# Altium schematic sheet SynchDemod.SchDoc
size Tabloid
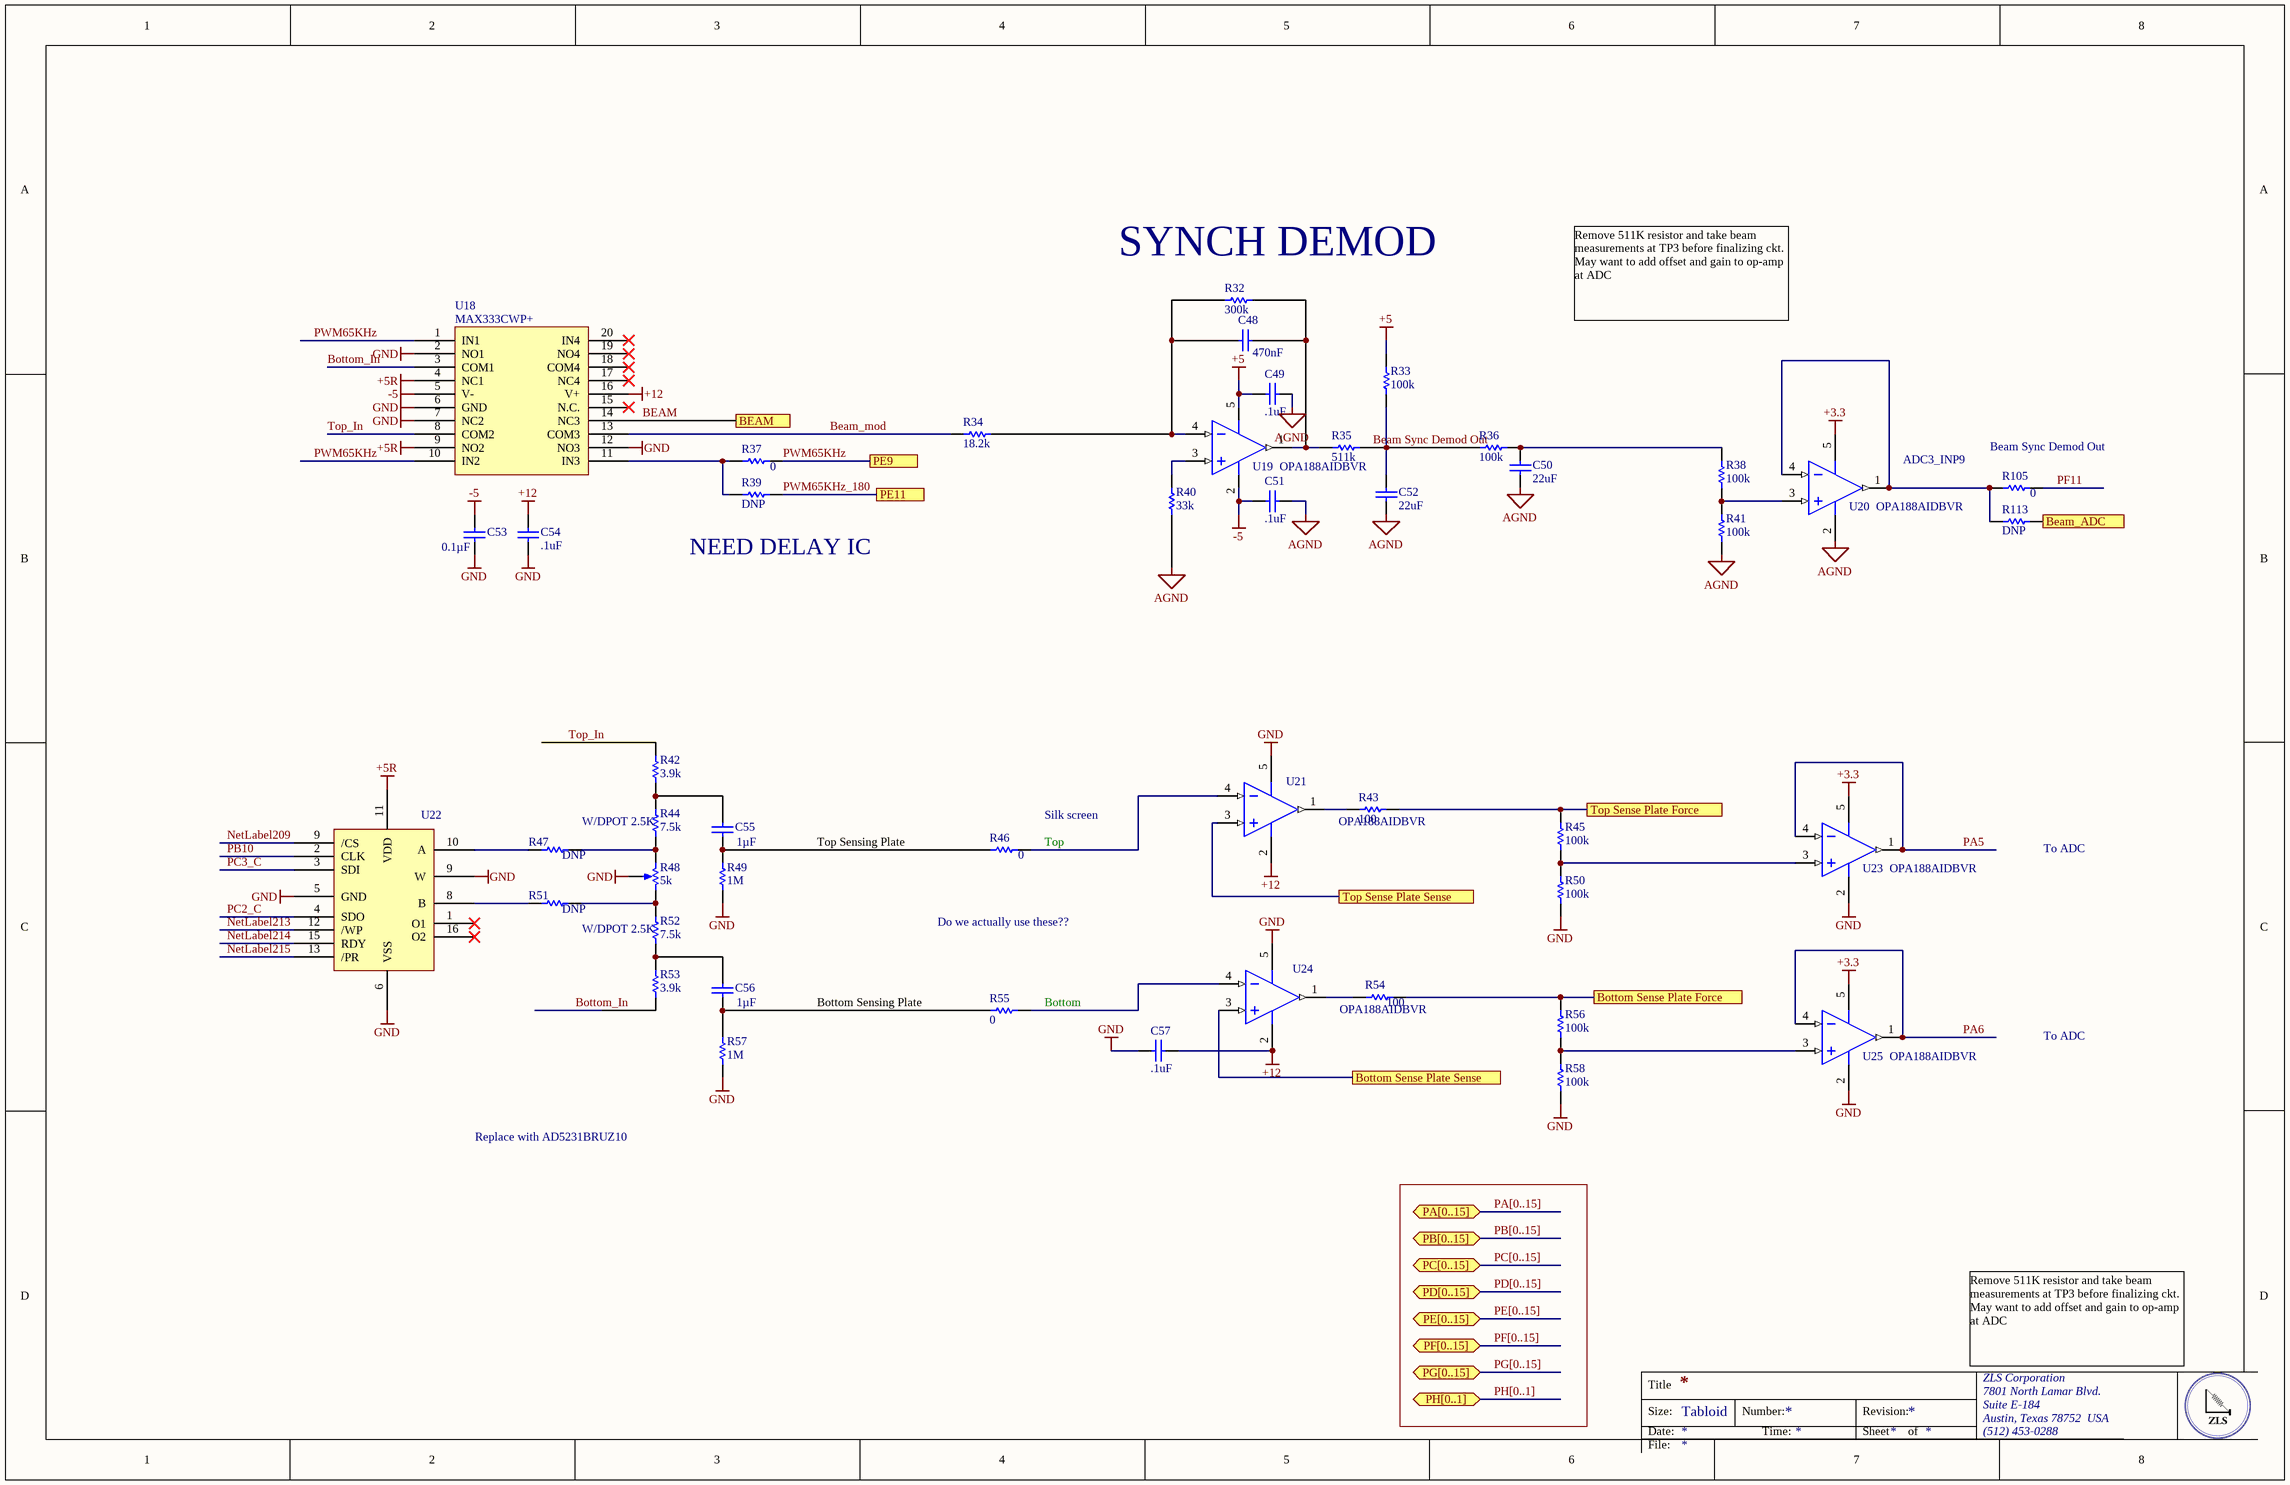
[diagram p0: SynchDemod.SchDoc]

## Parts
C48  470nF  [CAPC0805(2012)75_L]
C49  .1uF  [CAPC0805(2012)75_L]
C50  22uF  [CAPC0805(2012)75_L]
C51  .1uF  [CAPC0805(2012)75_L]
C52  22uF  [CAPC0805(2012)75_L]
C53  Capacitance: 0.1µF  [CAPC0805(2012)145_N]  (hidden comment: CAP CER 0.1UF 25V X7R 0805)
C54  .1uF  [CAPC0805(2012)75_L]
C55  Capacitance: 1µF  [CAPC0805(2012)155_L]  (hidden comment: CAP CER 1UF 25V X7R 0805)
C56  Capacitance: 1µF  [CAPC0805(2012)155_L]  (hidden comment: CAP CER 1UF 25V X7R 0805)
C57  .1uF  [CAPC0805(2012)75_M]
R32  300k  [RESC0805(2012)_L]
R33  100k  [RESC0805(2012)_L]
R34  18.2k  [RESC0805(2012)_L]
R35  511k  [RESC0805(2012)_L]
R36  100k  [RESC0805(2012)_L]
R37  0  [RESC0805(2012)_L]
R38  100k  [RESC0805(2012)_L]
R39  DNP  [RESC0805(2012)_L]
R40  33k  [RESC0805(2012)_L]
R41  100k  [RESC0805(2012)_L]
R42  3.9k  [RESC0805(2012)_L]
R43  100  [RESC0805(2012)_L]
R44  7.5k  [RESC0805(2012)_L]
R45  100k  [RESC0805(2012)_L]
R46  0  [RESC0805(2012)_L]
R47  DNP  [RESC0805(2012)_L]
R48  Resistance (Ohms): 5k  [Trimmer 2.54]  (hidden comment: TRIMMER 5K OHM 0.25W PC PIN)
R49  1M  [RESC0805(2012)_L]
R50  100k  [RESC0805(2012)_L]
R51  DNP  [RESC0805(2012)_L]
R52  7.5k  [RESC0805(2012)_L]
R53  3.9k  [RESC0805(2012)_L]
R54  100  [RESC0805(2012)_L]
R55  0  [RESC0805(2012)_L]
R56  100k  [RESC0805(2012)_L]
R57  1M  [RESC0805(2012)_L]
R58  100k  [RESC0805(2012)_L]
R105  0  [RESC0805(2012)_L]
R113  DNP  [RESC0805(2012)_L]
U18  MAX333CWP+  [TSOP65P640X90-20N]
U19  OPA188AIDBVR  [DBV0005A_M]
U20  OPA188AIDBVR  [DBV0005A_M]
U21  OPA188AIDBVR  [DBV0005A_M]
U22  AD5231BRUZ10  [AD5231BRUZ10]  (value not drawn)
U23  OPA188AIDBVR  [DBV0005A_M]
U24  OPA188AIDBVR  [DBV0005A_M]
U25  OPA188AIDBVR  [DBV0005A_M]

## Ports
BEAM, Beam_ADC, Bottom Sense Plate Force, Bottom Sense Plate Sense, PA[0..15] (bidir), PB[0..15] (bidir), PC[0..15] (bidir), PD[0..15] (bidir), PE9, PE11, PE[0..15] (bidir), PF[0..15] (bidir), PG[0..15] (bidir), PH[0..1] (bidir), Top Sense Plate Force, Top Sense Plate Sense

## Nets
+3.3: U20.5(V+) U23.5(V+) U25.5(V+)
+5: C49.1 R33.2 U19.5(V+)
+5R: U18.4(NC1) U18.9(NO2) U22.11(VDD)
+12: C54.2 C57.2 U18.16(V+) U21.2(V-) U24.2(V-)
-5: C51.1 C53.1 U18.5(V-) U19.2(V-)
AGND: C49.2 C50.1 C51.2 C52.1 R40.1 R41.1 U20.2(V-)
GND: C53.2 C54.1 C57.1 R48.2(b) R49.1 R50.1 R57.1 R58.1 U18.2(NO1) U18.6(GND) U18.7(NC2) U18.12(NO3) U21.5(V+) U22.5(GND) U22.6(VSS) U22.9(W) U23.2(V-) U24.5(V+) U25.2(V-)
BEAM: U18.14(NC3) ; port BEAM
Beam Sync Demod Out: C52.2 R33.1 R35.1 R36.2
Beam_ADC: R113.1 ; port Beam_ADC
Beam_mod: R34.2 U18.13(COM3)
Bottom Sense Plate Force: R54.1 R56.2 ; port Bottom Sense Plate Force
Bottom Sense Plate Sense: U24.3(IN+) ; port Bottom Sense Plate Sense
Bottom_In: R53.1 U18.3(COM1)
NetLabel209: U22.9(/CS)
NetLabel213: U22.12(/WP)
NetLabel214: U22.15(RDY)
NetLabel215: U22.13(/PR)
PA5: U23.1(OUT) U23.4(IN-)
PA6: U25.1(OUT) U25.4(IN-)
PB10: U22.2(CLK)
PC2_C: U22.4(SDO)
PC3_C: U22.3(SDI)
PF11: R105.1
PWM65KHz: R37.1 U18.1(IN1) U18.10(IN2) ; port PE9
PWM65KHz_180: R39.1 ; port PE11
Top Sense Plate Force: R43.1 R45.2 ; port Top Sense Plate Force
Top Sense Plate Sense: U21.3(IN+) ; port Top Sense Plate Sense
Top_In: R42.2 U18.8(COM2)
NetC48_1: C48.1 R32.2 R34.1 U19.4(IN-)
NetC48_2: C48.2 R32.1 R35.2 U19.1(OUT)
NetC50_2: C50.2 R36.1 R38.2
NetC55_1: C55.1 R46.2 R49.2
NetC55_2: C55.2 R42.1 R44.2
NetC56_1: C56.1 R55.2 R57.2
NetC56_2: C56.2 R52.1 R53.2
NetR37_2: R37.2 R39.2 U18.11(IN3)
NetR38_1: R38.1 R41.2 U20.3(IN+)
NetR40_2: R40.2 U19.3(IN+)
NetR43_2: R43.2 U21.1(OUT)
NetR44_1: R44.1 R47.1 R48.1(a)
NetR45_1: R45.1 R50.2 U23.3(IN+)
NetR46_1: R46.1 U21.4(IN-)
NetR47_2: R47.2 U22.10(A)
NetR48_3: R48.3(c) R51.1 R52.2
NetR51_2: R51.2 U22.8(B)
NetR54_2: R54.2 U24.1(OUT)
NetR55_1: R55.1 U24.4(IN-)
NetR56_1: R56.1 R58.2 U25.3(IN+)
NetR105_2: R105.2 R113.2 U20.1(OUT) U20.4(IN-)

Not connected (* = marked no-connect by the designer): U18 15(N.C.)* 17(NC4)* 18(COM4)* 19(NO4)* 20(IN4)*; U22 1(O1)* 16(O2)*

## Buses and harness runs
bus PA[0..15] = port PA[0..15]
bus PB[0..15] = port PB[0..15]
bus PC[0..15] = port PC[0..15]
bus PD[0..15] = port PD[0..15]
bus PE[0..15] = port PE[0..15]
bus PF[0..15] = port PF[0..15]
bus PG[0..15] = port PG[0..15]
bus PH[0..1] = port PH[0..1]

## Notes on the sheet
- (near R32) SYNCH DEMOD
- Remove 511K resistor and take beam measurements at TP3 before finalizing ckt.
  May want to add offset and gain to op-amp at ADC
- ADC3_INP9
- (near R105) Beam Sync Demod Out
- (near R39) NEED DELAY IC
- (near R44) W/DPOT 2.5K
- (near R46) Silk screen
- Top Sensing Plate
- (near R46) Top
- To ADC
- (near R52) W/DPOT 2.5K
- Do we actually use these??
- Bottom Sensing Plate
- (near R55) Bottom
- Replace with AD5231BRUZ10
- Title
- Size:
- Date:
- Tabloid
- Number:
- Time:
- Revision:
- Sheet
- of
- ZLS Corporation
- 7801 North Lamar Blvd.
- Suite E-184
- Austin, Texas 78752  USA
- (512) 453-0288
- File:

## Library data of the parts
C48 = CMP-1036-02117-1: CAP 150pF 16V ±10% 0805 (2012 Metric) Thickness 0.75mm SMD; Case-EIA: 0805; Tolerance: Â±10%; Value: .47uF; Case-Metric: 2012; Technology: SMT; Max Thickness: 0.75 mm; Rated Voltage: 16 V
C49-C52 C54 = CMP-1036-02117-1: CAP 150pF 16V ±10% 0805 (2012 Metric) Thickness 0.75mm SMD; Case-EIA: 0805; Tolerance: Â±10%; Case-Metric: 2012; Technology: SMT; Max Thickness: 0.75 mm; Rated Voltage: 16 V
  C49 C51 C54: Value: .1uF
  C50 C52: Value: 22uF
C53 = CMP-1036-04795-1: Manufacturer: Murata Electronics North America; Manufacturer Part Number: GRM21BR71E104KA01L; Tolerance: ±10%; Supplier 1: Digi-Key; Supplier Part Number 1: 490-1673-6-ND; RoHS: RoHS Compliant; Category: Capacitors; Stock 1: 891652; Pricing 1: 1=0.2, 10=0.145, 100=0.0683, 500=0.04788, 1000=0.03964 (USD); Packaging: Digi-Reel®; Part Status: Active; Voltage - Rated: 25V; Temperature Coefficient: X7R; Operating Temperature: -55°C ~ 125°C; Features: -; Ratings: -; Applications: General Purpose; Mounting Type: Surface Mount, MLCC; Package / Case: 0805 (2012 Metric); Size / Dimension: 0.079" L x 0.049" W (2.00mm x 1.25mm); Height - Seated (Max): -; Thickness (Max): 0.053" (1.35mm); Lead Spacing: -; Lead Style: -; ComponentLink1URL: http://www.murata.com/~/media/webrenewal/support/library/catalog/products/capacitor/mlcc/c02e.ashx; ComponentLink1Description: http://www.murata.com/~/media/webrenewal/support/library/catalog/products/capacitor/mlcc/c02e.ashx
C55 C56 = CMP-1036-04882-1: Manufacturer: Murata Electronics North America; Manufacturer Part Number: GRM21BR71E105KA99L; Tolerance: ±10%; Supplier 1: Digi-Key; Supplier Part Number 1: 490-6484-6-ND; RoHS: RoHS Compliant; Category: Capacitors; Stock 1: 295074; Pricing 1: 1=0.14, 10=0.099, 100=0.0468, 500=0.0328, 1000=0.02715 (USD); Packaging: Digi-Reel®; Part Status: Active; Voltage - Rated: 25V; Temperature Coefficient: X7R; Operating Temperature: -55°C ~ 125°C; Features: -; Ratings: -; Applications: General Purpose; Mounting Type: Surface Mount, MLCC; Package / Case: 0805 (2012 Metric); Size / Dimension: 0.079" L x 0.049" W (2.00mm x 1.25mm); Height - Seated (Max): -; Thickness (Max): 0.053" (1.35mm); Lead Spacing: -; Lead Style: -; ComponentLink1URL: http://www.murata.com/~/media/webrenewal/support/library/catalog/products/capacitor/mlcc/c02e.ashx; ComponentLink1Description: http://www.murata.com/~/media/webrenewal/support/library/catalog/products/capacitor/mlcc/c02e.ashx
C57 = CMP-1036-01414-1: CAP 33pF 25V ±2% 0805 (2012 Metric) Thickness 0.75mm SMD; Tolerance: Â±2%; Case-Metric: 2012; Case-EIA: 0805; Value: .1uF; Max Thickness: 0.75 mm; Rated Voltage: 25 V; Technology: SMT
R32-R38 R40-R42 R44-R46 R49 R50 R52 R53 R55-R58 R105 = CMP-1013-00215-1: 2R55 0.125W 1% 0805 (2012 Metric)  SMD; Case-Metric: 2012; Case-EIA: 0805; Tolerance: 1 %; Technology: SMT; Power: 0.125 W
  R32: Value: 300k
  R33 R36 R38 R41 R45 R50 R56 R58: Value: 100k
  R34: Value: 18.2k
  R35: Value: 511k
  R37 R46 R55 R105: Value: 0
  R40: Value: 33k
  R42 R53: Value: 3.9k
  R44 R52: Value: 7.5k
  R49 R57: Value: 1M
R39 R43 R47 R51 R54 R113 = CMP-1013-00215-1: 2R55 0.125W 1% 0805 (2012 Metric)  SMD; Case-Metric: 2012; Value: 0; Case-EIA: 0805; Tolerance: 1 %; Technology: SMT; Power: 0.125 W
R48 = Trimmer: Manufacturer: Vishay Foil Resistors (Division of Vishay Precision Group); Manufacturer Part Number: Y00535K00000J0L; Power (Watts): 0.25W, 1/4W; Tolerance: ±5%; Temperature Coefficient: ±10ppm/°C; Number of Turns: 21; Adjustment Type: Side Adjustment; Resistive Material: Metal Foil; Supplier 1: Digi-Key; Supplier Part Number 1: 804-1020-ND; RoHS: RoHS Compliant; Category: Potentiometers, Variable Resistors; Stock 1: 679; Pricing 1: 1=34.42, 10=32.265, 25=26.5292, 50=22.944, 100=22.227, 250=20.793, 500=19.2156 (USD); Packaging: Bulk; Part Status: Active; Mounting Type: Through Hole; Termination Style: PC Pins; Size / Dimension: Rectangular - 0.250" x 0.175" Face x 0.250" L (6.35mm x 4.45mm x 6.35mm); ComponentLink1URL: http://www.vishaypg.com/docs/63053/1240.pdf; ComponentLink1Description: http://www.vishaypg.com/docs/63053/1240.pdf
U18 = MAX333CWP+: IC SWITCH QUAD SPDT 20TSSOP; Manufacturer: Maxim; Manufacturer Part Number: MAX333AEUP+; Max Supply Voltage: 30V; Min Supply Voltage: 10V; Min Dual Supply Voltage: 4.5V; Max Dual Supply Voltage: 20V; On-State Resistance: 35R; Operating Supply Current: 1uA; Supply Type: Single,Dual; Max Power Dissipation: 559mW; Turn-On Delay Time: 175ns; Turn-Off Delay Time: 145ns; Max Supply Current: 250uA; Number of Bits: 4; Dual Supply Voltage: 15V; Supplier 1: Mouser; Supplier Part Number 1: 700-MAX333AEUP; Stock 1: 664; Pricing 1: 1=6.77, 10=6.43, 50=5.8, 100=5.8, 1000=5.62, 10000=5.62 (USD); Case/Package: TSSOP; Number of Pins: 20; Weight: 0.006737oz; Min Operating Temperature: -40°C; Max Operating Temperature: 85°C; Packaging: Rail/Tube; Package Quantity: 74; Throw Configuration: SPDT; Number of Channels: 4; Length: 6.6mm; Height: 0.95mm; Width: 4.5mm; Radiation Hardening: No; Lead Free: Lead Free; REACH SVHC: Unknown; ComponentLink1URL: https://datasheet.ciiva.com/2978/max333a-2978850.pdf; ComponentLink1Description: https://datasheet.ciiva.com/2978/max333a-2978850.pdf; ComponentLink2URL: https://datasheet.ciiva.com/30478/0900766b81253c85-30478260.pdf; ComponentLink2Description: https://datasheet.ciiva.com/30478/0900766b81253c85-30478260.pdf; ComponentLink3URL: https://datasheet.ciiva.com/1674/max333a-1674617.pdf; ComponentLink3Description: https://datasheet.ciiva.com/1674/max333a-1674617.pdf; ComponentLink4URL: https://datasheet.ciiva.com/26825/max333aeup-26825546.pdf; ComponentLink4Description: https://datasheet.ciiva.com/26825/max333aeup-26825546.pdf
U19-U21 U23-U25 = CMP-0809-00005-2: Precision, Low Noise, Rail-to-Rail Output, Zero-Drift Operational Amplifier, 4 to 36 V, -40 to 125 degC, 5-pin SOT23 (DBV5), Green (RoHS & no Sb/Br); Manufacturer: Texas Instruments; Total Supply Voltage(Min)(+5V is 5, +/-5V is 10): 4; Offset Drift(Typ)(uV/C): 0.03; Rating: Catalog; SubFamily: Zero Drift Precision Amplifier; GBW(Typ)(MHz): 2; Slew Rate(Typ)(V/us): 0.8; Number of Channels: 1; CMRR(Min)(dB): 120; Iq per channel(Max)(mA): 0.51; Total Supply Voltage(Max)(+5V is 5, +/-5V is 10): 36; PartNumber: OPA188AIDBVR; ComponentLink2Description: Datasheet; ComponentLink2URL: http://www.ti.com/lit/ds/symlink/opa188.pdf; ComponentLink1Description: Manufacturer URL; Mounting Technology: Surface Mount; Eco-Plan: Green (RoHS & no Sb/Br); ComponentLink1URL: http://www.ti.com/; PackageVersion: 4073253-4/K, 03/2006; DatasheetVersion: SBOS642A; ComponentLink3Description: Package Specification; PackageReference: DBV0005A; ComponentLink3URL: http://www.ti.com/litv/pdf/mpds018i; PackageDescription: 5-Pin Plastic Small Outline, Body 1.6 x 2.9 mm, Pitch 0.95 mm; Code_JEDEC: MO-178